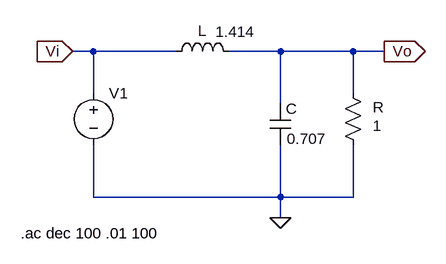
[diagram p0: schematic tp2 rlc.asc]
tp2 rlc.asc, the LTspice schematic file:
Version 4
SHEET 1 880 680
WIRE -48 112 -80 112
WIRE 80 112 -48 112
WIRE 240 112 160 112
WIRE 352 112 240 112
WIRE 400 112 352 112
WIRE -48 176 -48 112
WIRE 352 176 352 112
WIRE 240 192 240 112
WIRE -48 336 -48 256
WIRE 240 336 240 256
WIRE 240 336 -48 336
WIRE 352 336 352 256
WIRE 352 336 240 336
WIRE 240 368 240 336
FLAG -80 112 Vi
IOPIN -80 112 In
FLAG 400 112 Vo
IOPIN 400 112 Out
FLAG 240 368 0
SYMBOL ind 64 128 R270
WINDOW 0 32 56 VTop 2
WINDOW 3 31 106 VTop 2
SYMATTR InstName L
SYMATTR Value 1.414
SYMBOL res 336 160 R0
WINDOW 0 46 38 Left 2
WINDOW 3 46 66 Left 2
SYMATTR InstName R
SYMATTR Value 1
SYMBOL cap 224 192 R0
WINDOW 3 26 54 Left 2
SYMATTR InstName C
SYMATTR Value 0.707
SYMBOL voltage -48 160 R0
WINDOW 3 24 96 Invisible 2
WINDOW 39 0 0 Left 0
SYMATTR InstName V1
SYMATTR Value SINE(0 1 0 0 0 0 1000)
SYMATTR Value2 AC 1 0
TEXT -160 392 Left 2 !.ac dec 100 .01 100

The netlist it stands for:
* tp2 rlc.asc
L Vi Vo 1.414
R Vo 0 1
C Vo 0 0.707
V1 Vi 0 SINE(0 1 0 0 0 0 1000) AC 1 0
.ac dec 100 .01 100
.backanno
.end